# Altium schematic sheet Power.SchDoc: POWER
size A3; DrawnBy: Gad; Revision: 0.1v; SheetNumber: 1; SheetTotal: 3; PageTitle: POWER
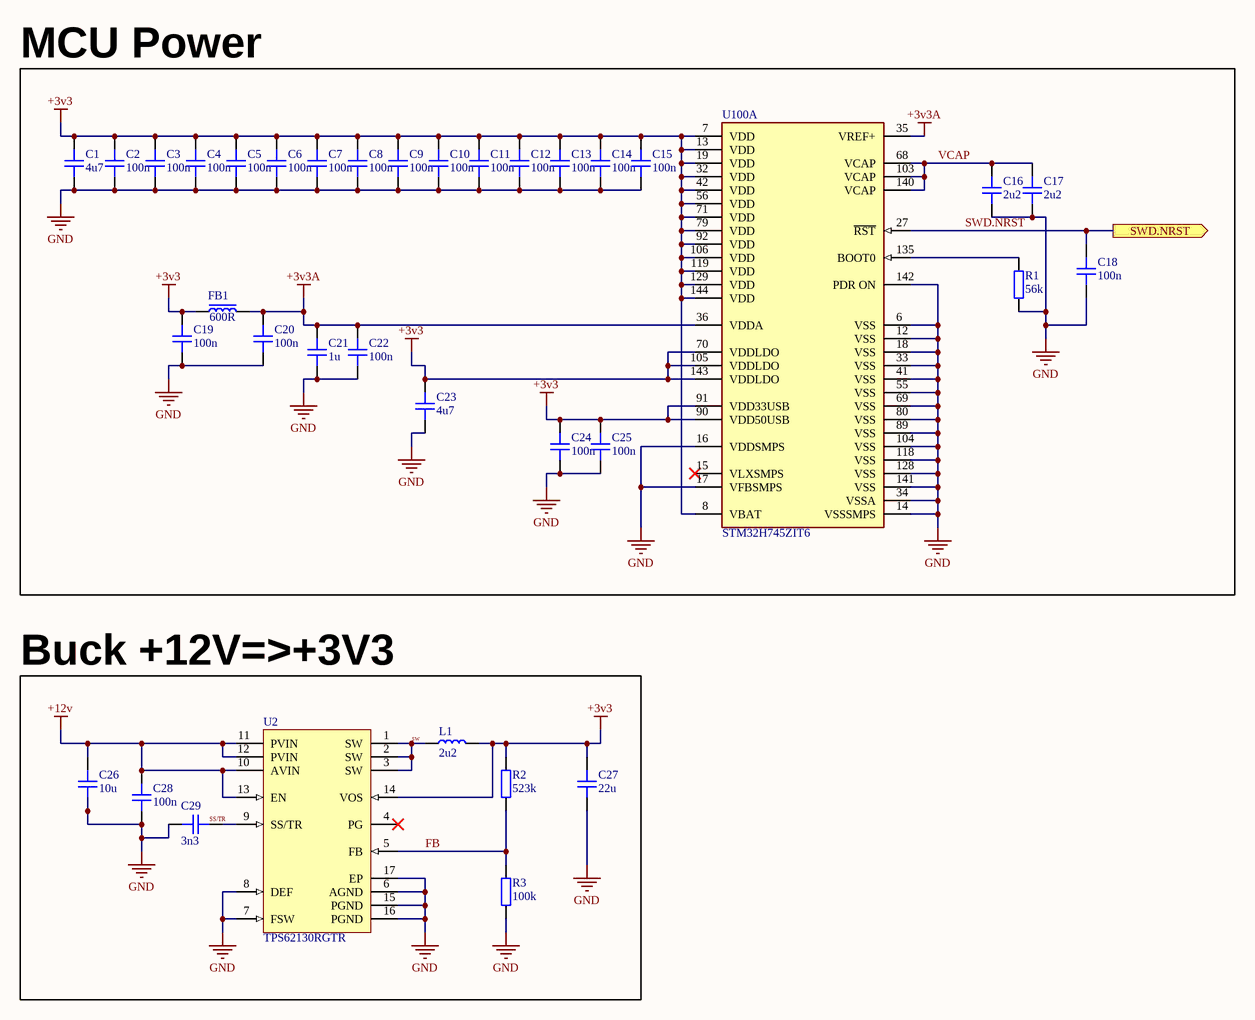
[diagram p0: Power.SchDoc]

## Parts
C1  4u7  [CAP_0603]
C2  100n  [CAP_0402]
C3  100n  [CAP_0402]
C4  100n  [CAP_0402]
C5  100n  [CAP_0402]
C6  100n  [CAP_0402]
C7  100n  [CAP_0402]
C8  100n  [CAP_0402]
C9  100n  [CAP_0402]
C10  100n  [CAP_0402]
C11  100n  [CAP_0402]
C12  100n  [CAP_0402]
C13  100n  [CAP_0402]
C14  100n  [CAP_0402]
C15  100n  [CAP_0402]
C16  2u2  [CAP_0402]
C17  2u2  [CAP_0402]
C18  100n  [CAP_0402]
C19  100n  [CAP_0402]
C20  100n  [CAP_0402]
C21  1u  [CAP_0402]
C22  100n  [CAP_0402]
C23  4u7  [CAP_0603]
C24  100n  [CAP_0402]
C25  100n  [CAP_0402]
C26  10u  [CAP_0805]
C27  22u  [CAP_0805]
C28  100n  [CAP_0402]
C29  3n3  [CAP_0402]
FB1  600R  [FB_0603]
L1  2u2  [IND_1008]
R1  56k  [RES_0402]
R2  523k  [RES_0402]
R3  100k  [RES_0402]
U2  TPS62130RGTR  [RGT0016C_V]
U100  STM32H745ZIT6  [FP-LQFP144-1A-MFG]  (part A of 3)

## Blocks framed on the sheet
MCU Power: C1-C25 FB1 R1 U100
Buck +12V=>+3V3: C26-C29 L1 R2 R3 U2

## Ports
SWD.NRST (out, see IO[3C])

## Nets
+3v3: C1.2 C2.2 C3.2 C4.2 C5.2 C6.2 C7.2 C8.2 C9.2 C10.2 C11.2 C12.2 C13.2 C14.2 C15.2 C19.2 C23.2 C24.2 C25.2 C27.2 FB1.1 L1.2 R2.2 U2.14(VOS) U100.7(VDD) U100.8(VBAT) U100.13(VDD) U100.19(VDD) U100.32(VDD) U100.42(VDD) U100.56(VDD) U100.70(VDDLDO) U100.71(VDD) U100.79(VDD) U100.90(VDD50USB) U100.91(VDD33USB) U100.92(VDD) U100.105(VDDLDO) U100.106(VDD) U100.119(VDD) U100.129(VDD) U100.143(VDDLDO) U100.144(VDD)
+3v3A: C20.2 C21.2 C22.2 FB1.2 U100.35(VREF+) U100.36(VDDA)
+12v: C26.2 C28.2 U2.10(AVIN) U2.11(PVIN) U2.12(PVIN) U2.13(EN)
GND: C1.1 C2.1 C3.1 C4.1 C5.1 C6.1 C7.1 C8.1 C9.1 C10.1 C11.1 C12.1 C13.1 C14.1 C15.1 C16.1 C17.1 C18.1 C19.1 C20.1 C21.1 C22.1 C23.1 C24.1 C25.1 C26.1 C27.1 C28.1 C29.2 R1.1 R3.1 U2.6(AGND) U2.7(FSW) U2.8(DEF) U2.15(PGND) U2.16(PGND) U2.17(EP) U100.6(VSS) U100.12(VSS) U100.14(VSSSMPS) U100.16(VDDSMPS) U100.17(VFBSMPS) U100.18(VSS) U100.33(VSS) U100.34(VSSA) U100.41(VSS) U100.55(VSS) U100.69(VSS) U100.80(VSS) U100.89(VSS) U100.104(VSS) U100.118(VSS) U100.128(VSS) U100.141(VSS) U100.142(PDR_ON)
FB: R2.1 R3.2 U2.5(FB)
SW: L1.1 U2.1(SW) U2.2(SW) U2.3(SW)
SWD.NRST: C18.2 U100.27(~{RST}) ; port SWD.NRST
VCAP: C16.2 C17.2 U100.68(VCAP) U100.103(VCAP) U100.140(VCAP)
NetC29_1: C29.1 U2.9(SS/TR)
NetR1_2: R1.2 U100.135(BOOT0)

Not connected (* = marked no-connect by the designer): U2 4(PG)*; U100 15(VLXSMPS)*

## Notes on the sheet
- Labels drawn without touching a wire or pin: SS/TR
- Title
- Size
- Rev
- Date:
- File:
- A3
- Drawn By:

## Library data of the parts
C1 C23 = CAP_0603: Capacitor SMD 0603; Manufacturer: *; Manufacturer Part Number: *; Distributor Link: *; LCSC: *; Rating: *; Dielectric: *
C2-C22 C24 C25 C28 C29 = CAP_0402: Capacitor SMD 0402; Manufacturer: *; Manufacturer Part Number: *; Distributor Link: *; LCSC: *; Rating: *; Dielectric: *
C26 C27 = CAP_0805: Capacitor SMD 0805; Manufacturer: *; Manufacturer Part Number: *; Distributor Link: *; LCSC: *; Rating: *; Dielectric: *
FB1 = FB_0603: Ferrite Bead SMD 0603 2A 350mΩ 600Ω@100MHz ±25%; Manufacturer: *; Manufacturer Part Number: *; Distributor Link: *; LCSC: *
L1 = IND_1008: Inductor SMD 1008
R1-R3 = RES_0402: Resistor SMD 0402; Manufacturer: *; Manufacturer Part Number: *; Distributor Link: *; LCSC: *
U2 = CMP-0323-00115-3: Buck Step Down Regulator with 3 to 17 V Input and 0.9 to 6 V Output, -40 to 85 degC, 16-Pin QFN (RGT), Green (RoHS & no Sb/Br); Manufacturer: Texas Instruments; Rating: Catalog; Vout(Max)(V): 6; Vin(Min)(V): 3; Switch Current Limit(Typ)(A): 4.2; Iq(Typ)(mA): 0.017; Regulated Outputs(#): 1; Synchronous Rectification: TRUE; SubFamily: Step-Down Regulator; Vin(Max)(V): 17; Duty Cycle(Max)(%): 100; Vout(Min)(V): 0.9; ComponentLink2URL: http://www.ti.com/litv/pdf/mpqf119g; Eco-Plan: Green (RoHS & no Sb/Br); PartNumber: TPS62130RGTR; ComponentLink1Description: Datasheet; DatasheetVersion: SLVSAG7; Mounting Technology: Surface Mount; Iout(Max)(A): 3; ComponentLink2Description: Package Specification; Code_JEDEC: MO-220; Topology: Buck; ComponentLink1URL: http://www.ti.com/general/docs/lit/getliterature.tsp?genericPartNumber=TPS62130&fileType=pdf; ComponentLink3URL: Samples URL:http://www.ti.com/product/tps62130#samples; ComponentLink3Description: URL Link1; PackageReference: RGT0016C; PackageVersion: revH, Oct-2011; PackageDescription: 16-Pin Plastic Quad Flat No-Lead, 3 x 3 mm Body, 0.5 mm Pitch, 1.7 x 1.7 mm Exposed Pad
U100 = CMP-12105-000054-1: HIGH-PERFORMANCE AND DSP WITH DP; Manufacturer: STMicroelectronics; Number Of Timers/Counters: 20; Min Supply Voltage: 1.62V; Frequency: 480MHz; Number Of I2C Channels: 4; Memory Type: FLASH; Number Of I/Os: 97; Number Of Pwm Channels: 42; Number Of Usb Channels: 2; Ram Size: 1MBytes; Memory Size: 2MBytes; Data Bus Width: 32bits; Number Of Adc Channels: 23; Number Of Ethernet Channels: 1; Number Of Uart Channels: 9; Interface: I2C,SPI,UART,USART,CAN,USB,LIN,IrDA,Ethernet,I2S,Other; Number Of A/D Converters: 3; Max Junction Temp: +125°C; Max Supply Voltage: 3.6V; Core Architecture: ARM Cortex-M4, Cortex-M7; Number Of Spi Channels: 6; Standoff Height: 0.05mm; Ambient Temperature Range Low: -40°C; Lead Free: Yes; Manufacturer Part Number: STM32H745ZIT6; Automotive: No; Height: 1.6mm; Device Class L1: Integrated Circuits (ICs); Ambient Temperature Range High: +85°C; RoHS: TRUE; Temperature Range High: +125°C; Temperature: -40°C to +125°C; Category: IC; Device Class L2: Embedded Processors and Controllers; Number Of Cores: 2; Temperature Range Low: -40°C; Octopart: https://octopart.com/stm32h745zit6-stmicroelectronics-100293939; Digikey Description: HIGH-PERFORMANCE AND DSP WITH DP; Package: LQFP144-1A; Device Class L3: Microcontrollers; ComponentLink2URL: https://www.st.com/resource/en/datasheet/stm32h745zi.pdf; ComponentLink2Description: Datasheet